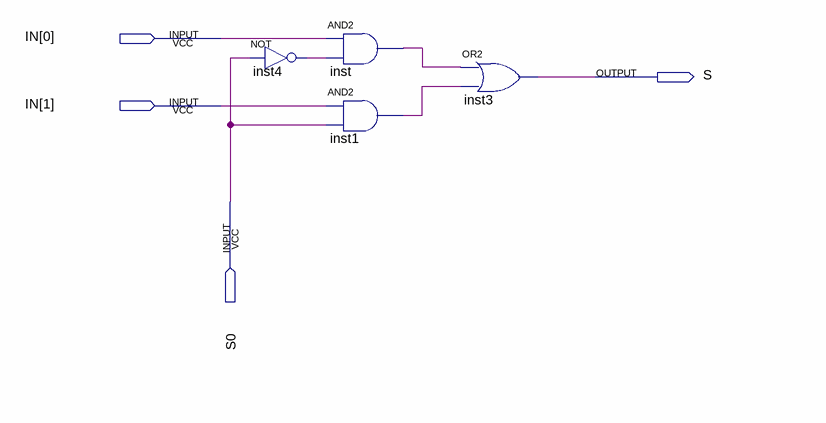
[diagram p0: schematic sheet]
// Quartus schematic MUX_2_1.bdf as structural Verilog: 4 symbols, 4 pins
module MUX_2_1 (
  input  [1:0] IN,
  input  S0,
  output S
);

  wire inst1_out, inst4_out, inst_out;

  not inst4 (inst4_out, S0);
  and inst (inst_out, IN[0], inst4_out);
  and inst1 (inst1_out, IN[1], S0);
  or inst3 (S, inst_out, inst1_out);
endmodule
